# Altium schematic sheet FPGA Supply.SchDoc
size A3
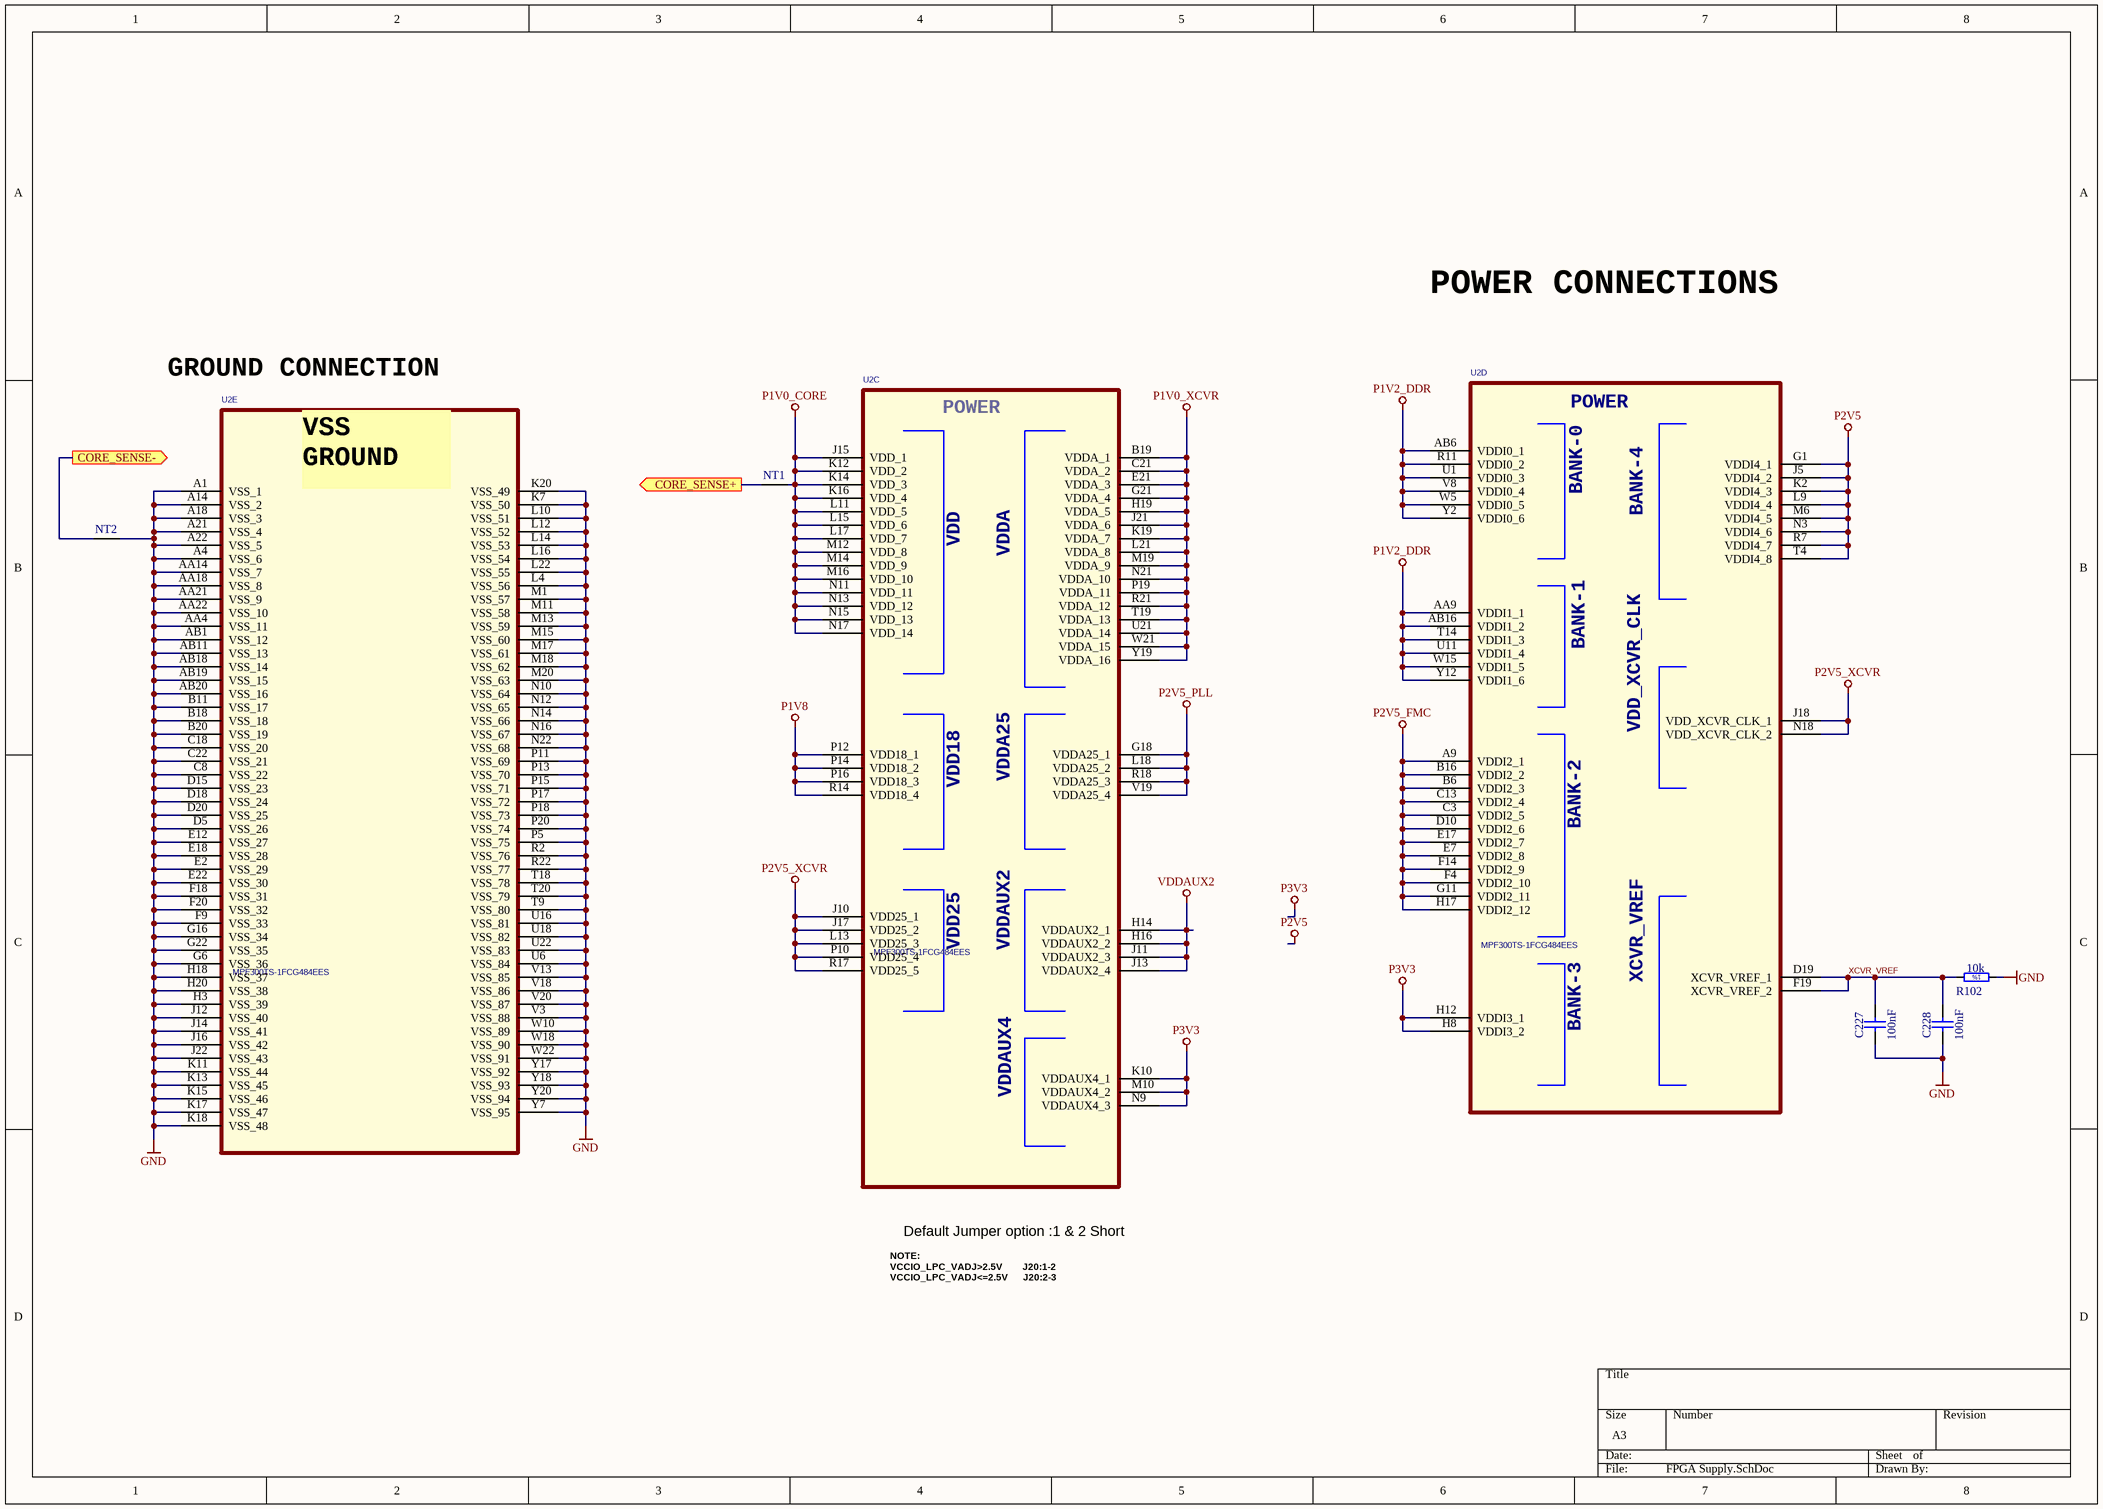
[diagram p0: FPGA Supply.SchDoc]

## Parts
C227  100nF  [CAPC0603X33N]
C228  100nF  [CAPC0603X33N]
NT1  Net Tie  [Net Tie]  (value not drawn)  (net tie, no BOM)
NT2  Net Tie  [Net Tie]  (value not drawn)  (net tie, no BOM)
R102  10k  [RESC1005X40N]
U2  MPF300TS-1FCG484EES  [BGA484C100P22X22_2300X2300X320]  (parts C,D,E of 11)

## Ports
CORE_SENSE+ (out), CORE_SENSE- (out)

## Nets
GND: C227.1 C228.1 NT2.2 R102.1 U2.A1(VSS_1) U2.A4(VSS_6) U2.A14(VSS_2) U2.A18(VSS_3) U2.A21(VSS_4) U2.A22(VSS_5) U2.AA4(VSS_11) U2.AA14(VSS_7) U2.AA18(VSS_8) U2.AA21(VSS_9) U2.AA22(VSS_10) U2.AB1(VSS_12) U2.AB11(VSS_13) U2.AB18(VSS_14) U2.AB19(VSS_15) U2.AB20(VSS_16) U2.B11(VSS_17) U2.B18(VSS_18) U2.B20(VSS_19) U2.C8(VSS_22) U2.C18(VSS_20) U2.C22(VSS_21) U2.D5(VSS_26) U2.D15(VSS_23) U2.D18(VSS_24) U2.D20(VSS_25) U2.E2(VSS_29) U2.E12(VSS_27) U2.E18(VSS_28) U2.E22(VSS_30) U2.F9(VSS_33) U2.F18(VSS_31) U2.F20(VSS_32) U2.G6(VSS_36) U2.G16(VSS_34) U2.G22(VSS_35) U2.H3(VSS_39) U2.H18(VSS_37) U2.H20(VSS_38) U2.J12(VSS_40) U2.J14(VSS_41) U2.J16(VSS_42) U2.J22(VSS_43) U2.K7(VSS_50) U2.K11(VSS_44) U2.K13(VSS_45) U2.K15(VSS_46) U2.K17(VSS_47) U2.K18(VSS_48) U2.K20(VSS_49) U2.L4(VSS_56) U2.L10(VSS_51) U2.L12(VSS_52) U2.L14(VSS_53) U2.L16(VSS_54) U2.L22(VSS_55) U2.M1(VSS_57) U2.M11(VSS_58) U2.M13(VSS_59) U2.M15(VSS_60) U2.M17(VSS_61) U2.M18(VSS_62) U2.M20(VSS_63) U2.N10(VSS_64) U2.N12(VSS_65) U2.N14(VSS_66) U2.N16(VSS_67) U2.N22(VSS_68) U2.P5(VSS_75) U2.P11(VSS_69) U2.P13(VSS_70) U2.P15(VSS_71) U2.P17(VSS_72) U2.P18(VSS_73) U2.P20(VSS_74) U2.R2(VSS_76) U2.R22(VSS_77) U2.T9(VSS_80) U2.T18(VSS_78) U2.T20(VSS_79) U2.U6(VSS_84) U2.U16(VSS_81) U2.U18(VSS_82) U2.U22(VSS_83) U2.V3(VSS_88) U2.V13(VSS_85) U2.V18(VSS_86) U2.V20(VSS_87) U2.W10(VSS_89) U2.W18(VSS_90) U2.W22(VSS_91) U2.Y7(VSS_95) U2.Y17(VSS_92) U2.Y18(VSS_93) U2.Y20(VSS_94)
P1V0_CORE: NT1.2 U2.J15(VDD_1) U2.K12(VDD_2) U2.K14(VDD_3) U2.K16(VDD_4) U2.L11(VDD_5) U2.L15(VDD_6) U2.L17(VDD_7) U2.M12(VDD_8) U2.M14(VDD_9) U2.M16(VDD_10) U2.N11(VDD_11) U2.N13(VDD_12) U2.N15(VDD_13) U2.N17(VDD_14)
P1V0_XCVR: U2.B19(VDDA_1) U2.C21(VDDA_2) U2.E21(VDDA_3) U2.G21(VDDA_4) U2.H19(VDDA_5) U2.J21(VDDA_6) U2.K19(VDDA_7) U2.L21(VDDA_8) U2.M19(VDDA_9) U2.N21(VDDA_10) U2.P19(VDDA_11) U2.R21(VDDA_12) U2.T19(VDDA_13) U2.U21(VDDA_14) U2.W21(VDDA_15) U2.Y19(VDDA_16)
P1V2_DDR: U2.AA9(VDDI1_1) U2.AB6(VDDI0_1) U2.AB16(VDDI1_2) U2.R11(VDDI0_2) U2.T14(VDDI1_3) U2.U1(VDDI0_3) U2.U11(VDDI1_4) U2.V8(VDDI0_4) U2.W5(VDDI0_5) U2.W15(VDDI1_5) U2.Y2(VDDI0_6) U2.Y12(VDDI1_6)
P1V8: U2.P12(VDD18_1) U2.P14(VDD18_2) U2.P16(VDD18_3) U2.R14(VDD18_4)
P2V5: U2.G1(VDDI4_1) U2.J5(VDDI4_2) U2.K2(VDDI4_3) U2.L9(VDDI4_4) U2.M6(VDDI4_5) U2.N3(VDDI4_6) U2.R7(VDDI4_7) U2.T4(VDDI4_8)
P2V5_FMC: U2.A9(VDDI2_1) U2.B6(VDDI2_3) U2.B16(VDDI2_2) U2.C3(VDDI2_5) U2.C13(VDDI2_4) U2.D10(VDDI2_6) U2.E7(VDDI2_8) U2.E17(VDDI2_7) U2.F4(VDDI2_10) U2.F14(VDDI2_9) U2.G11(VDDI2_11) U2.H17(VDDI2_12)
P2V5_PLL: U2.G18(VDDA25_1) U2.L18(VDDA25_2) U2.R18(VDDA25_3) U2.V19(VDDA25_4)
P2V5_XCVR: U2.J10(VDD25_1) U2.J17(VDD25_2) U2.J18(VDD_XCVR_CLK_1) U2.L13(VDD25_3) U2.N18(VDD_XCVR_CLK_2) U2.P10(VDD25_4) U2.R17(VDD25_5)
P3V3: U2.H8(VDDI3_2) U2.H12(VDDI3_1) U2.K10(VDDAUX4_1) U2.M10(VDDAUX4_2) U2.N9(VDDAUX4_3)
VDDAUX2: U2.H14(VDDAUX2_1) U2.H16(VDDAUX2_2) U2.J11(VDDAUX2_3) U2.J13(VDDAUX2_4)
CORE_SENSE+: NT1.1 ; port CORE_SENSE+
CORE_SENSE-: NT2.1 ; port CORE_SENSE-
XCVR_VREF: C227.2 C228.2 R102.2 U2.D19(XCVR_VREF_1) U2.F19(XCVR_VREF_2)

## Notes on the sheet
- POWER CONNECTIONS
- GROUND CONNECTION
- Default Jumper option :1 & 2 Short
- NOTE:
  VCCIO_LPC_VADJ>2.5V        J20:1-2
  VCCIO_LPC_VADJ<=2.5V      J20:2-3
- (in symbol FPGA_MPF300T-FCG484, part C) POWER; VDD; VDDA; VDDA25; VDD18; VDD25; VDDAUX2; VDDAUX4
- (in symbol FPGA_MPF300T-FCG484, part D) POWER; BANK-0; BANK-4; BANK-1; VDD_XCVR_CLK; BANK-2; XCVR_VREF; BANK-3
- (in symbol FPGA_MPF300T-FCG484, part E) VSS / GROUND
- (in symbol R0402_10K_1%_0.0625W_100PPM) 1%

## Library data of the parts
C227 C228 = CC0201_100NF_6.3V_10%_X5R: Non-polarised capacitor; Manufacturer: GENERIC; Part Description: SMD Multilayer Chip Ceramic Capacitor; Manufacturer1 Part Number: 02016D104KAT2A; Voltage: 6.3V; TC: X5R; Tolerance: ±10%; Part Number: CC0201_100NF_6.3V_10%_X5R; Component Kind: Standard; Component Type: Standard; Pin Count: 2; Value: 100nF; Status: Not Recommended; Manufacturer Part Number: CC0201_100NF_6.3V_10%_X5R; Case: 0201; Mounted: Yes; Socket: No; SMD: Yes; Sense: No; Manufacturer1 Example: AVX; Manufacturer1 ComponentHeight: 0.33mm; HelpURL: \\cern.ch\dfs\Applications\Altium\Datasheets\CC0201_X5R_AVX.pdf; Author: CERN DEM JLC; CreateDate: 03/12/2007; LatestRevisionDate: 03/12/2007
NT1 NT2 = Net Tie: Part Description: Net Tie (2 Nets); Mounted: No; Part Number: Net Tie; Component Type: Net Tie; Pin Count: 2; Family: Net Tie; Socket: No; SMD: No; Sense: No; Status: None; ComponentHeight: 0mm; HelpURL: Undefined; Author: CERN DEM JLC; CreateDate: 22/03/2011; LatestRevisionDate: 22/03/2011; PackageDescription: 2 Plated Through Hole For Coaxial Cable Link: Hole Dia.=1.4mm Pad Dia.=2.5mm
R102 = R0402_10K_1%_0.0625W_100PPM: Resistor - 1%; Manufacturer: GENERIC; Part Description: General Purpose Thick Film Chip Resistor; Manufacturer1 Part Number: 232270671003L; TC: ±100ppm/°C; PressFit: No; Manufacturer Part Number: R0402_10K_1%_0.0625W_100PPM; Part Number: R0402_10K_1%_0.0625W_100PPM; Tolerance: ±1%; Value: 10k; Component Kind: Standard; Component Type: Standard; Pin Count: 2; Status: Not Recommended; Power: 0.0625W; Case: 0402; Mounted: Yes; Sense: No; Socket: No; SMD: Yes; Manufacturer1 Example: YAGEO PHYCOMP; Manufacturer1 ComponentHeight: 0.4mm; HelpURL: \\cern.ch\dfs\Applications\Altium\Datasheets\R0402_Phycomp_RC0402.pdf; Author: CERN DEM JLC; CreateDate: 03/12/2007; LatestRevisionDate: 17/10/2012
U2 = FPGA_MPF300T-FCG484: FCG484,23mmX23mm,1.0mm pitch; Manufacturer: Microsemi; Part Number: MPF300TS-1FCG484I